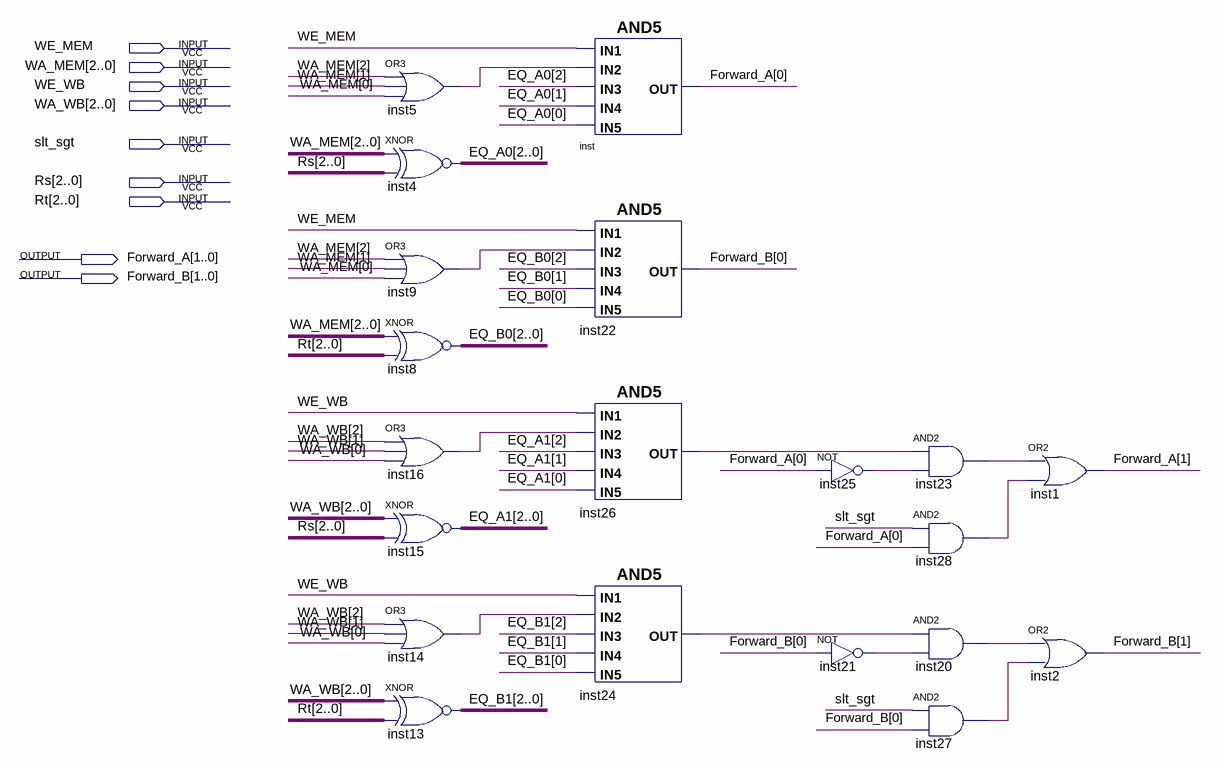
[diagram p0: schematic sheet]
// Quartus schematic Forwarding_Unit.bdf as structural Verilog: 20 symbols, 9 pins
module Forwarding_Unit (
  input  WE_MEM,
  input  [2:0] WA_MEM,
  input  WE_WB,
  input  [2:0] WA_WB,
  input  slt_sgt,
  input  [2:0] Rs,
  input  [2:0] Rt,
  output [1:0] Forward_A,
  output [1:0] Forward_B
);

  wire inst5_out, inst9_out, inst14_out, inst16_out, inst20_out, inst21_out, inst23_out, inst24_out,
       inst25_out, inst26_out, inst27_out, inst28_out;
  wire [2:0] EQ_A0, EQ_A1, EQ_B0, EQ_B1;

  or inst5 (inst5_out, WA_MEM[2], WA_MEM[1], WA_MEM[0]);
  assign EQ_A0 = ~(WA_MEM ^ Rs);  // XNOR inst4, 3 bits wide
  or inst9 (inst9_out, WA_MEM[2], WA_MEM[1], WA_MEM[0]);
  assign EQ_B0 = ~(WA_MEM ^ Rt);  // XNOR inst8, 3 bits wide
  or inst16 (inst16_out, WA_WB[2], WA_WB[1], WA_WB[0]);
  assign EQ_A1 = ~(WA_WB ^ Rs);  // XNOR inst15, 3 bits wide
  or inst14 (inst14_out, WA_WB[2], WA_WB[1], WA_WB[0]);
  assign EQ_B1 = ~(WA_WB ^ Rt);  // XNOR inst13, 3 bits wide
  and inst (Forward_A[0], WE_MEM, inst5_out, EQ_A0[2], EQ_A0[1], EQ_A0[0]);
  and inst22 (Forward_B[0], WE_MEM, inst9_out, EQ_B0[2], EQ_B0[1], EQ_B0[0]);
  and inst26 (inst26_out, WE_WB, inst16_out, EQ_A1[2], EQ_A1[1], EQ_A1[0]);
  and inst24 (inst24_out, WE_WB, inst14_out, EQ_B1[2], EQ_B1[1], EQ_B1[0]);
  not inst25 (inst25_out, Forward_A[0]);
  not inst21 (inst21_out, Forward_B[0]);
  and inst23 (inst23_out, inst26_out, inst25_out);
  and inst28 (inst28_out, slt_sgt, Forward_A[0]);
  and inst20 (inst20_out, inst24_out, inst21_out);
  and inst27 (inst27_out, slt_sgt, Forward_B[0]);
  or inst1 (Forward_A[1], inst23_out, inst28_out);
  or inst2 (Forward_B[1], inst20_out, inst27_out);
endmodule
